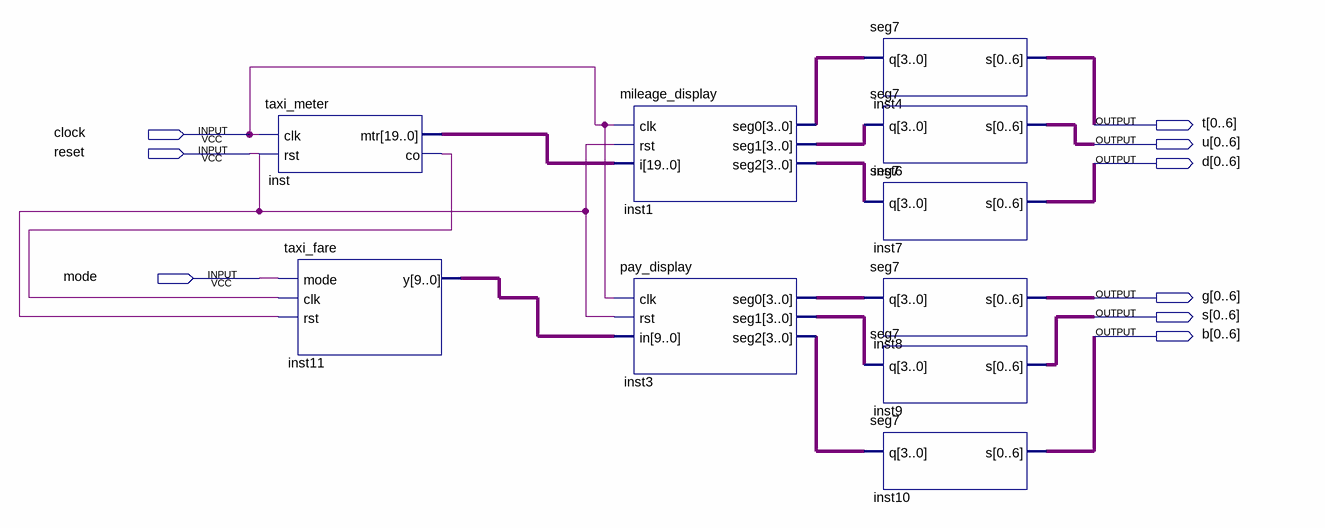
[diagram p0: schematic sheet]
// Quartus schematic taxi.bdf as structural Verilog: 10 symbols, 9 pins
module taxi (
  input  clock,
  input  reset,
  input  mode,
  output [0:6] t,
  output [0:6] u,
  output [0:6] d,
  output [0:6] g,
  output [0:6] s,
  output [0:6] b
);

  wire inst_co;
  wire [3:0] inst1_seg0, inst1_seg1, inst1_seg2, inst3_seg0, inst3_seg1, inst3_seg2;
  wire [9:0] inst11_y;
  wire [19:0] inst_mtr;

  taxi_meter inst (.clk(clock), .rst(reset), .mtr(inst_mtr), .co(inst_co));
  taxi_fare inst11 (.mode(mode), .clk(inst_co), .rst(reset), .y(inst11_y));
  mileage_display inst1 (
    .clk(clock), .rst(reset), .i(inst_mtr), .seg0(inst1_seg0), .seg1(inst1_seg1), .seg2(inst1_seg2));
  pay_display inst3 (.clk(clock), .rst(reset), .in(inst11_y), .seg0(inst3_seg0), .seg1(inst3_seg1), .seg2(inst3_seg2));
  seg7 inst4 (.q(inst1_seg0), .s(t));
  seg7 inst6 (.q(inst1_seg1), .s(u));
  seg7 inst7 (.q(inst1_seg2), .s(d));
  seg7 inst8 (.q(inst3_seg0), .s(g));
  seg7 inst9 (.q(inst3_seg1), .s(s));
  seg7 inst10 (.q(inst3_seg2), .s(b));
endmodule
